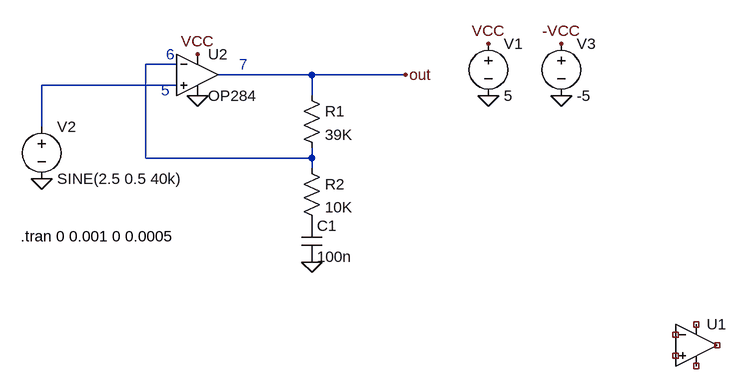
[diagram p0: schematic transmitter.asc]
transmitter.asc, the LTspice schematic file:
Version 4
SHEET 1 964 680
WIRE 112 112 64 112
WIRE 320 128 176 128
WIRE 464 128 320 128
WIRE 112 144 -96 144
WIRE 320 160 320 128
WIRE -96 208 -96 144
WIRE 64 256 64 112
WIRE 320 256 320 240
WIRE 320 256 64 256
WIRE 320 272 320 256
FLAG 320 416 0
FLAG 592 160 0
FLAG 592 80 VCC
FLAG 144 96 VCC
FLAG -96 288 0
FLAG 464 128 out
FLAG 704 160 0
FLAG 704 80 -VCC
FLAG 144 160 0
SYMBOL res 304 144 R0
SYMATTR InstName R1
SYMATTR Value 39K
SYMBOL res 304 256 R0
SYMATTR InstName R2
SYMATTR Value 10K
SYMBOL voltage 592 64 R0
WINDOW 123 0 0 Left 0
WINDOW 39 0 0 Left 0
SYMATTR InstName V1
SYMATTR Value 5
SYMBOL voltage -96 192 R0
WINDOW 123 0 0 Left 0
WINDOW 39 0 0 Left 0
SYMATTR InstName V2
SYMATTR Value SINE(2.5 0.5 40k)
SYMBOL Opamps\\OP284 144 64 R0
SYMATTR InstName U2
SYMBOL voltage 704 64 R0
WINDOW 123 0 0 Left 0
WINDOW 39 0 0 Left 0
SYMATTR InstName V3
SYMATTR Value -5
SYMBOL Opamps\\UniversalOpamp2 912 544 R0
SYMATTR InstName U1
SYMATTR Value2 Avol=1Meg GBW=10Meg Slew=7Meg
SYMATTR SpiceLine ilimit=1m rail=1 Vos=3000u phimargin=45
SYMBOL cap 304 352 R0
SYMATTR InstName C1
SYMATTR Value 100n
TEXT -128 376 Left 2 !.tran 0 0.001 0 0.0005
TEXT 208 112 Left 2 ;7
TEXT 96 96 Left 2 ;6
TEXT 88 152 Left 2 ;5

The netlist it stands for:
* transmitter.asc
R1 out N001 39K
R2 N001 P001 10K
V1 VCC 0 5
V2 N002 0 SINE(2.5 0.5 40k)
XU2 N002 N001 VCC 0 out OP284  ; pins In+ In- V+ V- OUT
V3 -VCC 0 -5
XU1 NC_01 NC_02 NC_03 NC_04 NC_05 level.2 Avol=1Meg GBW=10Meg Slew=7Meg ilimit=1m rail=1 Vos=3000u phimargin=45 en=0 enk=0 in=0 ink=0 Rin=500Meg  ; pins IN+ IN- V+ V- OUT
C1 P001 0 100n
.tran 0 0.001 0 0.0005
* 7
* 6
* 5
.lib ADI1.lib
.lib UniversalOpamps2.sub
.backanno
.end